# EAGLE schematic DVforArduino (EAGLE 6.4)
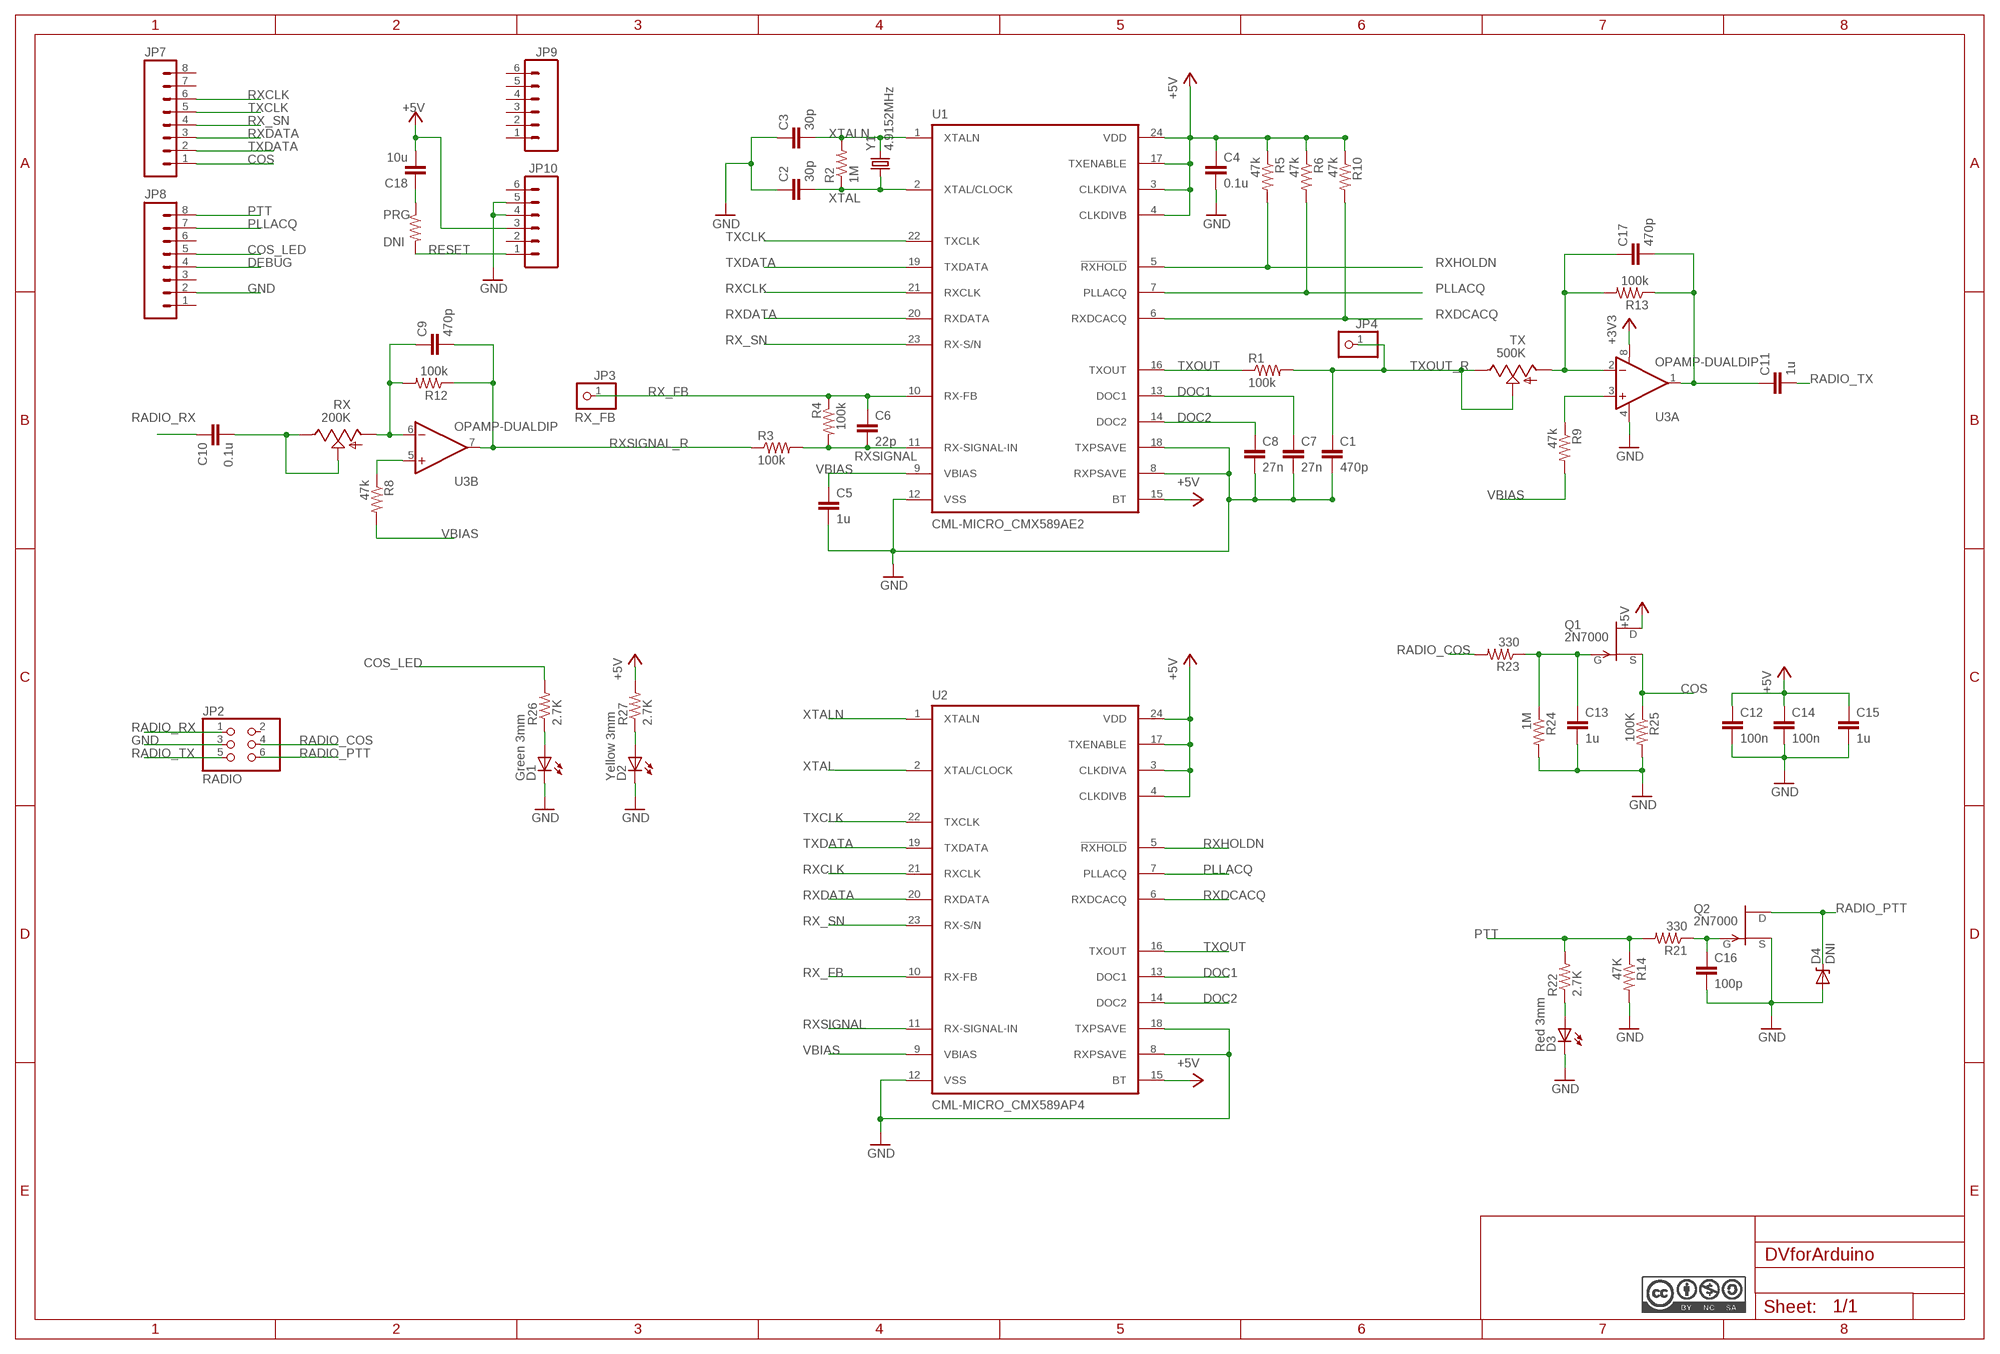
[diagram p0: schematic, sheet 1]

## Parts
C1  470p  C2,5-3  [C2.5-3]
C2  30p  C2,5-3  [C2.5-3]
C3  30p  C2,5-3  [C2.5-3]
C4  0.1u  C2,5-3  [C2.5-3]
C5  1u  C2,5-3  [C2.5-3]
C6  22p  C2,5-3  [C2.5-3]
C7  27n  C2,5-3  [C2.5-3]
C8  27n  C2,5-3  [C2.5-3]
C9  470p  C2,5-3  [C2.5-3]
C10  0.1u  C2,5-3  [C2.5-3]
C11  1u  C2,5-3  [C2.5-3]
C12  100n  C2,5-3  [C2.5-3]
C13  1u  C2,5-3  [C2.5-3]
C14  100n  C2,5-3  [C2.5-3]
C15  1u  C2,5-3  [C2.5-3]
C16  100p  C2,5-3  [C2.5-3]
C17  470p  C2,5-3  [C2.5-3]
C18  10u  C2,5-3  [C2.5-3]
D1  Green 3mm  LED3MM  [LED3MM]
D2  Yellow 3mm  LED3MM  [LED3MM]
D3  Red 3mm  LED3MM  [LED3MM]
D4  DNI  DIODE-ZENERPTH  [DIODE-ZENER]
JP2  RADIO  HEADER-2X3  [2X03_ROUND_70MIL]
JP3  RX_FB  HEADER-1X1ROUND  [1X01_ROUND]
JP4  HEADER-1X1ROUND  [1X01_ROUND]
JP7  M081X08  [1X08]
JP8  M081X08  [1X08]
JP9  M06SIP  [1X06]
JP10  M06SIP  [1X06]
PRG  DNI  R-US_0204/2V  [0204V]
Q1  2N7000  2N3819  [TO92]
Q2  2N7000  2N3819  [TO92]
R1  100k  R-US_0204/2V  [0204V]
R2  1M  R-US_0204/2V  [0204V]
R3  100k  R-US_0204/2V  [0204V]
R4  100k  R-US_0204/2V  [0204V]
R5  47k  R-US_0204/2V  [0204V]
R6  47k  R-US_0204/2V  [0204V]
R8  47k  R-US_0204/2V  [0204V]
R9  47k  R-US_0204/2V  [0204V]
R10  47k  R-US_0204/2V  [0204V]
R12  100k  R-US_0204/2V  [0204V]
R13  100k  R-US_0204/2V  [0204V]
R14  47K  R-US_0204/2V  [0204V]
R21  330  R-US_0204/2V  [0204V]
R22  2.7K  R-US_0204/2V  [0204V]
R23  330  R-US_0204/2V  [0204V]
R24  1M  R-US_0204/2V  [0204V]
R25  100K  R-US_0204/2V  [0204V]
R26  2.7K  R-US_0204/2V  [0204V]
R27  2.7K  R-US_0204/2V  [0204V]
RX  200K  TRIM_US-B25P  [B25P]
TX  500K  TRIM_US-B25P  [B25P]
U1  CML-MICRO_CMX589AE2  AIS_MK2_CML-MICRO_CMX589AE2  [AIS_MK2_CML-MICRO_TSSOP24]
U2  CML-MICRO_CMX589AP4  AIS_MK2_CML-MICRO_CMX589AP4  [AIS_MK2_CML-MICRO_DIL24-6]
U3  OPAMP-DUALDIP  [DIP08]
Y1  4.9152MHz  CRYSTALHC49US  [HC49US]

## Nets
+3V3 [pwr]: C4.1 C12.1 C14.1 C15.1 C18.2 JP10.3 Q1.1(D) R5.1 R6.1 R10.1 R27.2 U1.3(CLKDIVA) U1.4(CLKDIVB) U1.15(BT) U1.17(TXENABLE) U1.24(VDD) U2.3(CLKDIVA) U2.4(CLKDIVB) U2.15(BT) U2.17(TXENABLE) U2.24(VDD) U3.8(A:V+) ; supply symbol labelled +5V
COS: JP7.1 Q1.3(S) R25.1
COS_LED: JP8.5 R26.2
DEBUG: JP8.4
DOC1: C7.1 U1.13(DOC1) U2.13(DOC1)
DOC2: C8.1 U1.14(DOC2) U2.14(DOC2)
GND [pwr]: C1.2 C2.1 C3.1 C4.2 C5.2 C7.2 C8.2 C12.2 C13.2 C14.2 C15.2 C16.2 D1.K(C) D2.K(C) D3.K(C) D4.P$2(A) JP2.3 JP8.2 JP10.4 JP10.5 Q2.3(S) R14.2 R24.2 R25.2 U1.8(RXPSAVE) U1.12(VSS) U1.18(TXPSAVE) U2.8(RXPSAVE) U2.12(VSS) U2.18(TXPSAVE) U3.4(A:V-)
N$1: C13.1 Q1.2(G) R23.1 R24.1
N$2: D1.A R26.1
N$3: C10.2 RX.E RX.S
N$4: D2.A R27.1
N$6 [pwr]: C18.1 PRG.1
N$7: C9.1 R12.2 RX.A U3.6(B:-IN)
N$11: R8.1 U3.5(B:+IN)
N$15: C11.1 C17.2 R13.1 U3.1(A:OUT)
N$20: R9.1 U3.3(A:+IN)
N$24: C16.1 Q2.2(G) R21.1
N$28: C17.1 R13.2 TX.A U3.2(A:-IN)
N$33: D3.A R22.1
PLLACQ: JP8.7 R6.2 U1.7(PLLACQ) U2.7(PLLACQ)
PTT: JP8.8 R14.1 R21.2 R22.2
RADIO_COS: JP2.4 R23.2
RADIO_PTT: D4.P$1(C) JP2.6 Q2.1(D)
RADIO_RX: C10.1 JP2.1
RADIO_TX: C11.2 JP2.5
RESET: JP10.1 PRG.2
RX_FB: C6.1 JP3.1 R4.1 U1.10(RX-FB) U2.10(RX-FB)
RX_SN: JP7.4 U1.23(RX-S/N) U2.23(RX-S/N)
RXCLK: JP7.6 U1.21(RXCLK) U2.21(RXCLK)
RXDATA: JP7.3 U1.20(RXDATA) U2.20(RXDATA)
RXDCACQ: R10.2 U1.6(RXDCACQ) U2.6(RXDCACQ)
RXHOLDN: R5.2 U1.5(!RXHOLD!) U2.5(!RXHOLD!)
RXSIGNAL: C6.2 R3.2 R4.2 U1.11(RX-SIGNAL-IN) U2.11(RX-SIGNAL-IN)
RXSIGNAL_R: C9.2 R3.1 R12.1 U3.7(B:OUT)
TXCLK: JP7.5 U1.22(TXCLK) U2.22(TXCLK)
TXDATA: JP7.2 U1.19(TXDATA) U2.19(TXDATA)
TXOUT: R1.1 U1.16(TXOUT) U2.16(TXOUT)
TXOUT_R: C1.1 JP4.1 R1.2 TX.E TX.S
VBIAS: C5.1 R8.2 R9.2 U1.9(VBIAS) U2.9(VBIAS)
XTAL: C2.2 R2.1 U1.2(XTAL/CLOCK) U2.2(XTAL/CLOCK) Y1.1
XTALN: C3.2 R2.2 U1.1(XTALN) U2.1(XTALN) Y1.2
Unconnected: JP2.2 JP7.7 JP7.8 JP8.1 JP8.3 JP8.6 JP9.1 JP9.2 JP9.3 JP9.4 JP9.5 JP9.6 JP10.2 JP10.6

## Library data of the parts
C1-C18 = capacitor-wima:C: CAPACITOR naming: grid - package width
D1-D3 = adafruit:LED: LED OSRAM: - CHIPLED LG R971, LG N971, LY N971, LG Q971, LY Q971, LO R971, LY R971 LH N974, LH R974 LS Q976, LO Q976, LY Q976 LO Q996 - Hyper CHIPLED LW Q18S LB Q993, LB Q99A, LB R99A - SideLED LS A670, LO A670, LY A670, LG A670, LP A670 LB A673, LV A673, LT A673, LW A673 LH A674 LY A675 LS A676, LA A676, LO A676, LY A676, LW A676 LS A679, LY A679, LG A679 - Hyper Micro SIDELED® LS Y876, LA Y876, LO Y876, LY Y876 LT Y87S - SmartLED LW L88C, LW L88S LB L89C, LB L89S, LG L890 LS L89K, LO L89K, LY L89K LS L896, LA L896, LO L896, LY L896 - TOPLED LS T670, LO T670, LY T670, LG T670, LP T670 LSG T670, LSP T670, LSY T670, LOP T670, LYG T670 LG T671, LOG T671, LSG T671 LB T673, LV T673, LT T673, LW T673 LH T674 LS T676, LA T676, LO T676, LY T676, LB T676, LH T676, LSB T676, LW T676 LB T67C, LV T67C, LT T67C, LS T67K, LO T67K, LY T67K, LW E67C LS E67B, LA E67B, LO E67B, LY E67B, LB E67C, LV E67C, LT E67C LW T67C LS T679, LY T679, LG T679 LS T770, LO T770, LY T770, LG T770, LP T770 LB T773, LV T773, LT T773, LW T773 LH T774 LS E675, LA E675, LY E675, LS T675 LS T776, LA T776, LO T776, LY T776, LB T776 LHGB T686 LT T68C, LB T68C - Hyper Mini TOPLED® LB M676 - Mini TOPLED Santana® LG M470 LS M47K, LO M47K, LY M47K Source: http://www.osram.convergy.de/
D4 = SparkFun-DiscreteSemi:DIODE-ZENER: Zener Diode Production Part - 8199 3.4V Zener Voltage
JP2 = microbuilder:HEADER-2X3: PIN HEADER
JP3 JP4 = microbuilder:HEADER-1X1: PIN HEADER
JP7 JP8 = SparkFun-Connectors:M08: Header 8 Standard 8-pin 0.1" header. Use with straight break away headers (SKU : PRT-00116), right angle break away headers (PRT-00553), swiss pins (PRT-00743), machine pins (PRT-00117), and female headers (PRT-00115).
JP9 JP10 = SparkFun-Connectors:M06: Header 6 Standard 6-pin 0.1" header. Use with straight break away headers (SKU : PRT-00116), right angle break away headers (PRT-00553), swiss pins (PRT-00743), machine pins (PRT-00117), and female headers (PRT-00115). Molex polarized connector foot print use with SKU : PRT-08094 with associated crimp pins and housings. NOTES ON THE VARIANTS LOCK and LOCK_LONGPADS... This footprint was designed to help hold the alignment of a through-hole component (i.e. 6-pin header) while soldering it into place. You may notice that each hole has been shifted either up or down by 0.005 of an inch from it's more standard position (which is a perfectly straight line). This slight alteration caused the pins (the squares in the middle) to touch the edges of the holes. Because they are alternating, it causes a "brace" to hold the component in place. 0.005 has proven to be the perfect amount of "off-center" position when using our standard breakaway headers. Although looks a little odd when you look at the bare footprint, once you have a header in there, the alteration is very hard to notice. Also, if you push a header all the way into place, it is covered up entirely on the bottom side. This idea of altering the position of holes to aid alignment will be further integrated into the Sparkfun Library for other footprints. It can help hold any component with 3 or more connection pins.
PRG R1-R6 R8-R10 R12-R14 R21-R27 = resistor:R-US_: RESISTOR, American symbol
Q1 Q2 = transistor-fet:2N3819: N-Channel Junction FET
RX TX = pot:TRIM_US-: POTENTIOMETER
U1 = mylibrary:AIS_MK2_CML-MICRO_CMX589A: HIGH-SPEED GMSK MODEM
U2 = 12_dollar:AIS_MK2_CML-MICRO_CMX589A: HIGH-SPEED GMSK MODEM
U3 = SparkFun-AnalogIC:OPAMP-DUAL: Generic op-amp footprint
Y1 = SparkFun-FreqCtrl:CRYSTAL: Various standard crystals. Proven footprints. Spark Fun Electronics SKU : COM-00534

## Net classes
1 pwr: width 0.381 mm